# EAGLE design Sensor2 (EAGLE 6.3)
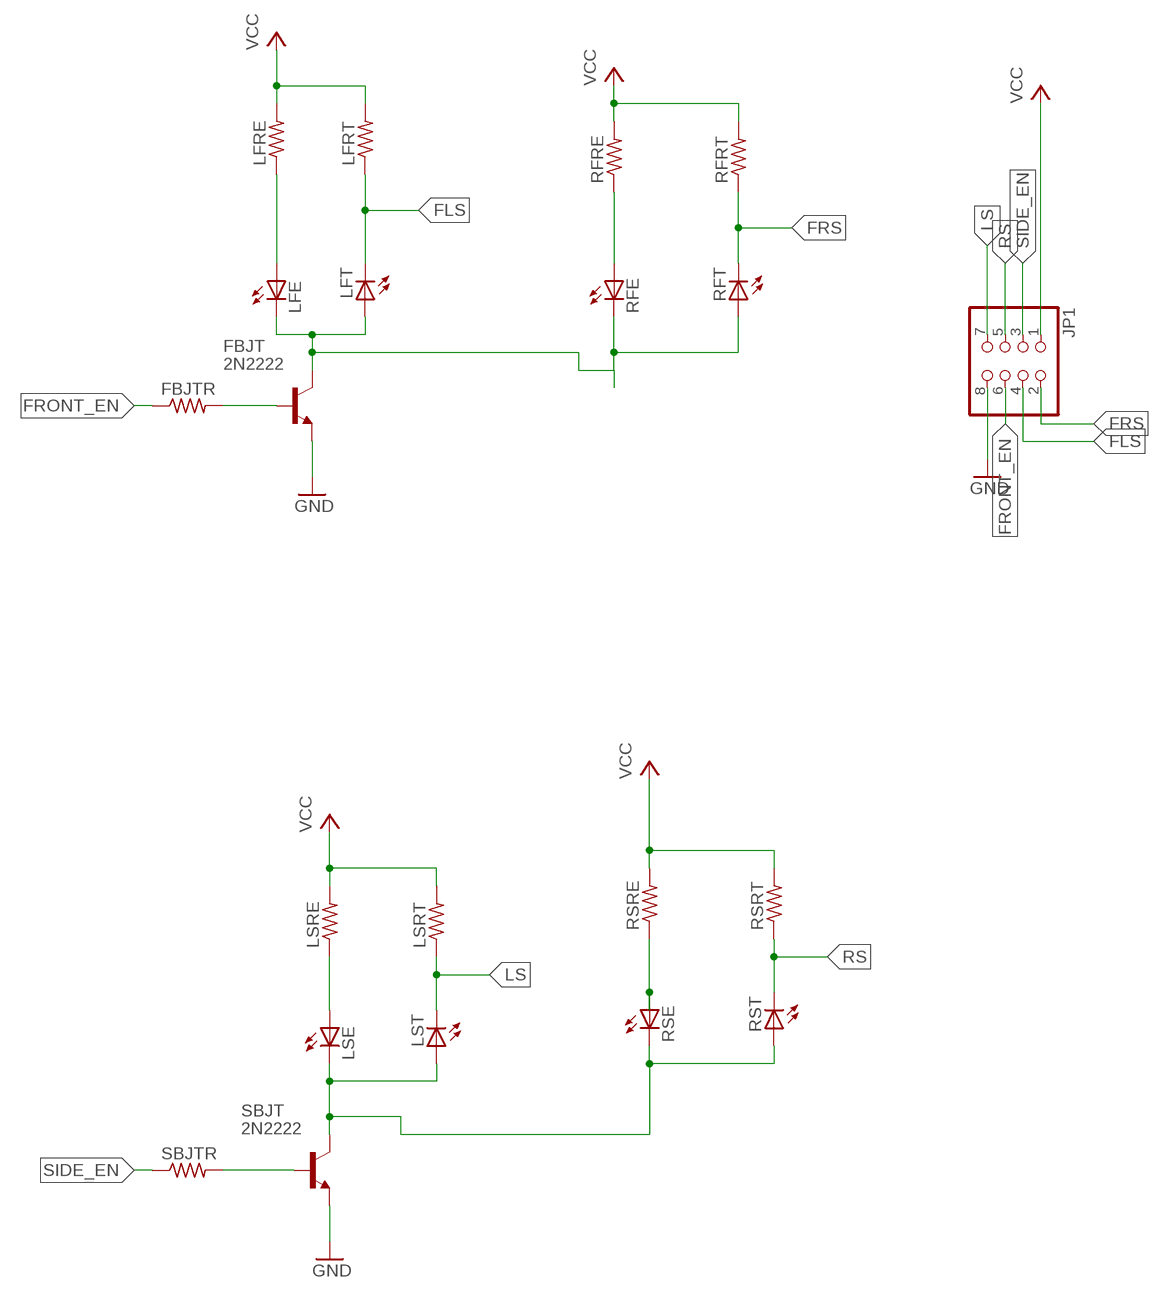
[diagram p0: schematic, sheet 1]

## Parts
FBJT  2N2222  [TO92-EBC-OVAL]
FBJTR  R-US_R0805  [R0805]
JP1  PINHD-2X4  [2X04]
LFE  LED5MM  [LED5MM]
LFRE  R-US_R0805  [R0805]
LFRT  R-US_R0805  [R0805]
LFT  LED5MM  [LED5MM]
LSE  LED5MM  [LED5MM]
LSRE  R-US_R0805  [R0805]
LSRT  R-US_R0805  [R0805]
LST  LED5MM  [LED5MM]
RFE  LED5MM  [LED5MM]
RFRE  R-US_R0805  [R0805]
RFRT  R-US_R0805  [R0805]
RFT  LED5MM  [LED5MM]
RSE  LED5MM  [LED5MM]
RSRE  R-US_R0805  [R0805]
RSRT  R-US_R0805  [R0805]
RST  LED5MM  [LED5MM]
SBJT  2N2222  [TO92-EBC-OVAL]
SBJTR  R-US_R0805  [R0805]

## Nets
FLS: JP1.4 LFRT.1 LFT.K(C)
FRONT_EN: FBJTR.1 JP1.6
FRS: JP1.2 RFRT.1 RFT.K(C)
GND: FBJT.E JP1.8 SBJT.E
LS: JP1.7 LSRT.1 LST.K(C)
N$1: LFE.A LFRE.1
N$2: FBJT.B FBJTR.2
N$3: FBJT.C LFE.K(C) LFT.A RFE.K(C) RFT.A
N$5: SBJT.B SBJTR.2
N$6: LSE.K(C) LST.A RSE.K(C) RST.A SBJT.C
N$7: RFE.A RFRE.1
N$10: LSE.A LSRE.1
N$11: RSE.A RSRE.1
RS: JP1.5 RSRT.1 RST.K(C)
SIDE_EN: JP1.3 SBJTR.1
VCC: JP1.1 LFRE.2 LFRT.2 LSRE.2 LSRT.2 RFRE.2 RFRT.2 RSRE.2 RSRT.2

## Library data of the parts
FBJT SBJT = adafruit:2N2222: NPN TRANSISTOR Big oval pads
FBJTR LFRE LFRT LSRE LSRT RFRE RFRT RSRE RSRT SBJTR = adafruit:R-US_: RESISTOR, American symbol
JP1 = adafruit:PINHD-2X4: PIN HEADER
LFE LFT LSE LST RFE RFT RSE RST = adafruit:LED: LED OSRAM: - CHIPLED LG R971, LG N971, LY N971, LG Q971, LY Q971, LO R971, LY R971 LH N974, LH R974 LS Q976, LO Q976, LY Q976 LO Q996 - Hyper CHIPLED LW Q18S LB Q993, LB Q99A, LB R99A - SideLED LS A670, LO A670, LY A670, LG A670, LP A670 LB A673, LV A673, LT A673, LW A673 LH A674 LY A675 LS A676, LA A676, LO A676, LY A676, LW A676 LS A679, LY A679, LG A679 - Hyper Micro SIDELED® LS Y876, LA Y876, LO Y876, LY Y876 LT Y87S - SmartLED LW L88C, LW L88S LB L89C, LB L89S, LG L890 LS L89K, LO L89K, LY L89K LS L896, LA L896, LO L896, LY L896 - TOPLED LS T670, LO T670, LY T670, LG T670, LP T670 LSG T670, LSP T670, LSY T670, LOP T670, LYG T670 LG T671, LOG T671, LSG T671 LB T673, LV T673, LT T673, LW T673 LH T674 LS T676, LA T676, LO T676, LY T676, LB T676, LH T676, LSB T676, LW T676 LB T67C, LV T67C, LT T67C, LS T67K, LO T67K, LY T67K, LW E67C LS E67B, LA E67B, LO E67B, LY E67B, LB E67C, LV E67C, LT E67C LW T67C LS T679, LY T679, LG T679 LS T770, LO T770, LY T770, LG T770, LP T770 LB T773, LV T773, LT T773, LW T773 LH T774 LS E675, LA E675, LY E675, LS T675 LS T776, LA T776, LO T776, LY T776, LB T776 LHGB T686 LT T68C, LB T68C - Hyper Mini TOPLED® LB M676 - Mini TOPLED Santana® LG M470 LS M47K, LO M47K, LY M47K Source: http://www.osram.convergy.de/

## Board
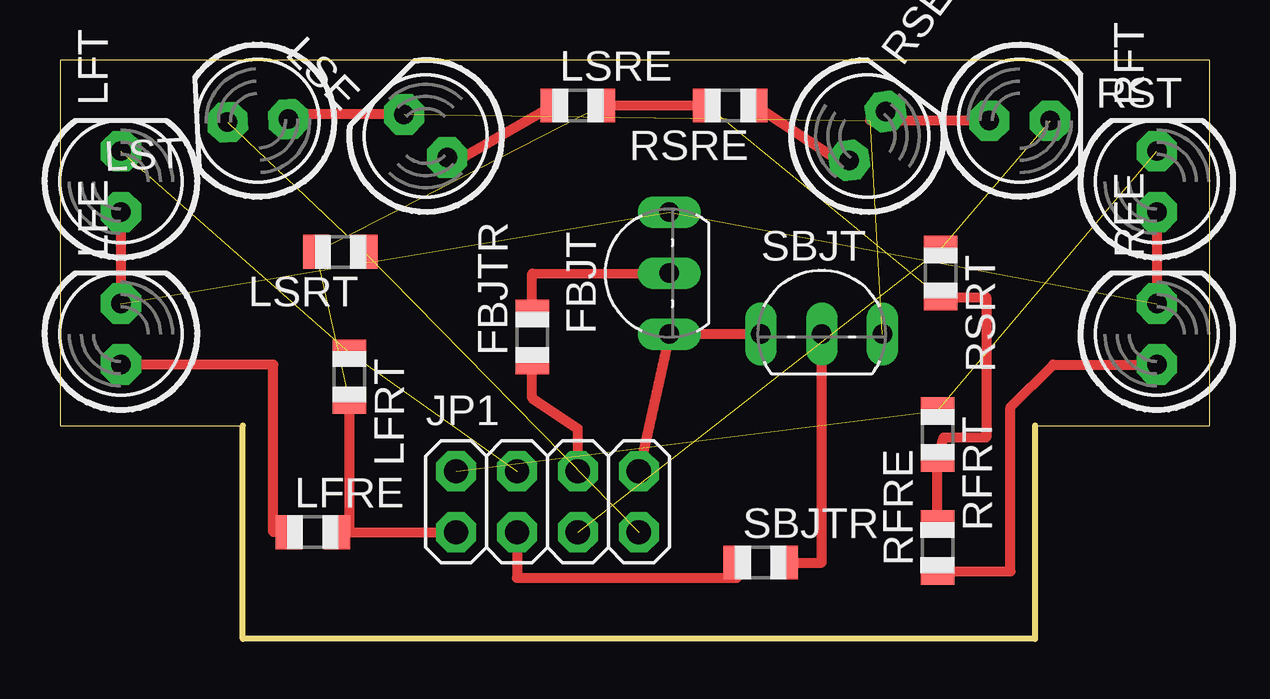
[diagram p1: board, top side]

Size 47.93 x 24.12 mm. Coordinates in mm from the lower left corner, seen from the top.
Outline: 0,8.89 7.62,8.89 7.62,0 40.64,0 40.64,8.89 47.93,8.89 47.93,24.12 0,24.12 0,8.89
Copper layers (1*16): Top 0.035mm / dielectric 1.5mm / Bottom 0.035mm
Design rules "default": minimum track width 10mil, minimum drill 24mil, track to track 8mil, track to pad 8mil, pad to pad 8mil, via to via 8mil, smd to smd 8mil, copper to edge 40mil, drill to drill 8mil, minimum pad ring 10mil, minimum via ring 8mil, stop-mask expansion 4mil, vias tented up to drill 0mil, thermal gap 10mil

### Footprints (pad centres in the part's own frame; a part is rotated, then mirrored left to right if it is on the bottom)
TO92-EBC-OVAL = drill 0.813 long: B 0,-1.27; C 2.54,-1.27; E -2.54,-1.27
R0805 = smd 1.1 x 1.4: 1 -1,0; 2 1,0
2X04 = drill 1.016 pad 1.676 octagon: 1 -3.81,-1.27; 2 -3.81,1.27; 3 -1.27,-1.27; 4 -1.27,1.27; 5 1.27,-1.27; 6 1.27,1.27; 7 3.81,-1.27; 8 3.81,1.27
LED5MM = drill 0.813 pad 1.676 octagon: A -1.27,0; K 1.27,0

### Placement (x,y rotation side)
FBJT  24.13,15.24 90 top
FBJTR  19.68,12.57 90 top
JP1  20.32,5.72 0 top
LFE  2.54,12.7 90 top
LFRE  10.54,4.45 0 top
LFRT  12.06,10.92 270 top
LFT  2.54,19.05 90 top
LSE  15.24,20.95 135 top
LSRE  21.59,22.23 0 top
LSRT  11.68,16.13 180 top
LST  8.26,21.59 182.8 top
RFE  45.72,12.7 90 top
RFRE  36.58,3.81 90 top
RFRT  36.58,8.51 270 top
RFT  45.72,19.05 90 top
RSE  33.66,20.95 53.2 top
RSRE  27.94,22.23 180 top
RSRT  36.7,15.24 270 top
RST  40.01,21.59 0 top
SBJT  31.75,13.97 0 top
SBJTR  29.21,3.18 0 top

### Tracks (layer width: path | path; a pad name or v marks a point on that pad's centre or on a via)
FLS  (2 unrouted)
FRONT_EN
  Top 0.406: JP1.6 21.59,8.76 19.68,10.03 FBJTR.1
FRS  (2 unrouted)
GND
  Top 0.406: JP1.8 FBJT.E SBJT.E
LS  (2 unrouted)
N$1
  Top 0.406: LFRE.1 8.89,4.45 8.89,11.43 LFE.A
N$2
  Top 0.406: FBJTR.2 19.68,15.22 FBJT.B
N$3  (2 unrouted)
  Top 0.406: LFT.A LFE.K | RFT.A RFE.K
N$5
  Top 0.406: SBJTR.2 31.75,3.18 SBJT.B
N$6  (2 unrouted)
  Top 0.406: LSE.K 10.16,21.85 LST.A | RST.A 33.78,21.59 RSE.K
N$7
  Top 0.406: RFRE.1 39.62,2.81 39.62,9.65 41.4,11.43 RFE.A
N$10
  Top 0.406: LSRE.1 16.77,20.05 LSE.A
N$11
  Top 0.406: RSRE.1 32.26,20.05 RSE.A
RS  (2 unrouted)
SIDE_EN
  Top 0.406: JP1.3 19.05,2.54 28.21,2.54 SBJTR.1
VCC  (3 unrouted)
  Top 0.406: JP1.1 LFRE.2 12.06,4.45 LFRT.2 | RFRE.2 RFRT.2 36.83,8.38 38.61,8.38 38.61,14.24 RSRT.2 | LSRE.2 RSRE.2